# Altium project smarchWatch_V5.PrjPcb
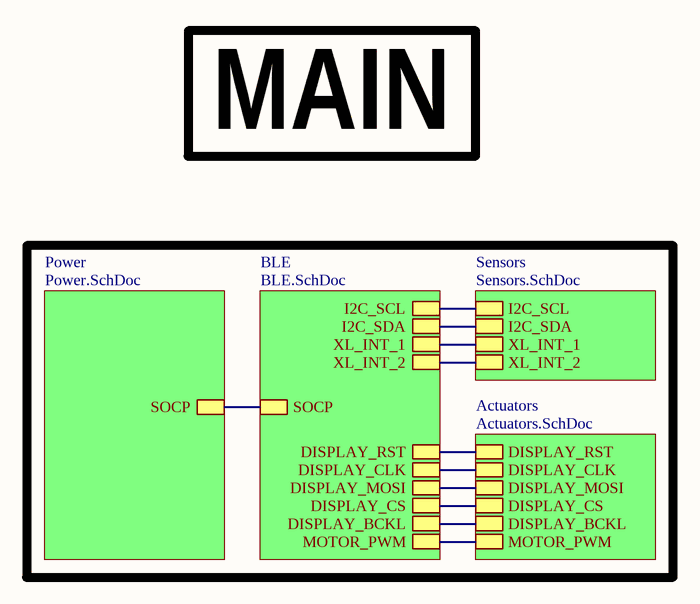
[diagram p0: Main.SchDoc]
5 sheets, 54 parts. Net scope: hierarchical (ports join the sheet entries above them; power ports are global).
Board file: smarchWatch_V5.PcbDoc
Sheets:
  Main.SchDoc
    Power = Power.SchDoc
    Actuators = Actuators.SchDoc
    BLE = BLE.SchDoc
    Sensors = Sensors.SchDoc

## Sheet Main.SchDoc
size A; DocumentNumber: 1; SheetNumber: 1; SheetTotal: 5

### Sub-sheets
Actuators = Actuators.SchDoc: DISPLAY_RST, DISPLAY_CLK, DISPLAY_MOSI, DISPLAY_CS, DISPLAY_BCKL, MOTOR_PWM
BLE = BLE.SchDoc: SOCP, DISPLAY_RST, DISPLAY_CLK, DISPLAY_MOSI, DISPLAY_CS, DISPLAY_BCKL, MOTOR_PWM, I2C_SCL, I2C_SDA, XL_INT_1, XL_INT_2
Power = Power.SchDoc: SOCP
Sensors = Sensors.SchDoc: I2C_SCL, I2C_SDA, XL_INT_1, XL_INT_2

### Nets
DISPLAY_BCKL: sheet Actuators/DISPLAY_BCKL, sheet BLE/DISPLAY_BCKL
DISPLAY_CLK: sheet Actuators/DISPLAY_CLK, sheet BLE/DISPLAY_CLK
DISPLAY_CS: sheet Actuators/DISPLAY_CS, sheet BLE/DISPLAY_CS
DISPLAY_MOSI: sheet Actuators/DISPLAY_MOSI, sheet BLE/DISPLAY_MOSI
DISPLAY_RST: sheet Actuators/DISPLAY_RST, sheet BLE/DISPLAY_RST
I2C_SCL: sheet BLE/I2C_SCL, sheet Sensors/I2C_SCL
I2C_SDA: sheet BLE/I2C_SDA, sheet Sensors/I2C_SDA
MOTOR_PWM: sheet Actuators/MOTOR_PWM, sheet BLE/MOTOR_PWM
SOCP: sheet Power/SOCP, sheet BLE/SOCP
XL_INT_1: sheet BLE/XL_INT_1, sheet Sensors/XL_INT_1
XL_INT_2: sheet BLE/XL_INT_2, sheet Sensors/XL_INT_2

### Notes on the sheet
- MAIN

## Sheet Power.SchDoc
size A; DocumentNumber: 2; SheetNumber: 2; SheetTotal: 5
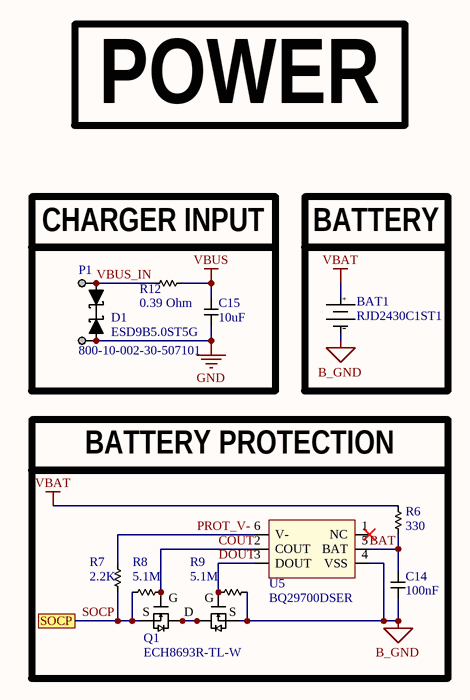
[diagram p1: Power.SchDoc]

### Parts
BAT1  RJD2430C1ST1  [RJD2430C1ST1]
C14  100nF  [CAP_0603_HIGH]
C15  10uF  [CAP_0603_HIGH]
D1  ESD9B5.0ST5G  [ESD9B5.0ST5G]
P1  800-10-002-30-507101  [800-10-002-30-507101]
Q1  ECH8693R-TL-W  [ECH8693R-TL-W]
R6  330  [RES_0603_HIGH]
R7  2.2K  [RES_0603_HIGH]
R8  5.1M  [RES_0603_HIGH]
R9  5.1M  [RES_0603_HIGH]
R12  0.39 Ohm  [RES_0805_HIGH]
U5  BQ29700DSER  [BQ29700DSER]

### Blocks framed on the sheet
CHARGER INPUT: C15 D1 P1 R12
BATTERY: BAT1
BATTERY PROTECTION: C14 Q1 R6-R9 U5

### Ports
SOCP

### Nets
B_GND: BAT1.2(-) C14.2 Q1.3(S2) R9.1 U5.4(VSS)
GND: C15.2 D1.1 P1.2
VBAT: BAT1.1(+) R6.1
VBUS: C15.1 R12.2
BAT: C14.1 R6.2 U5.5(BAT)
COUT: Q1.2(G1) R8.1 U5.2(COUT)
DOUT: Q1.4(G2) R9.2 U5.3(DOUT)
PROT_V-: R7.1 U5.6(V-)
SOCP: Q1.1(S1) R7.2 R8.2 ; port SOCP
VBUS_IN: D1.2 P1.1 R12.1
NetQ1_5: Q1.5(D) Q1.6(D) Q1.7(D) Q1.8(D)

Not connected (* = marked no-connect by the designer): U5 1(NC)*

### Notes on the sheet
- POWER
- (in symbol ECH8693R-TL-W) G; S

### Library data of the parts
BAT1 = RJD2430C1ST1: Coin, 24.5mm 3.7V Lithium-Ion Battery Rechargeable (Secondary) 110mAh
C14 C15 = Capacitor_0603: 0603 Capacitor
D1 = ESD9B5.0ST5G: TVS DIODE 5V SOD923
P1 = 800-10-002-30-507101: 2 Position Spring Mating Target Connector Surface Mount
Q1 = ECH8693R-TL-W: Mosfet Array 2 N-Channel (Dual) Common Drain 24V 14A 1.4W Surface Mount SOT-28FL/ECH8
R6-R9 = Resistor_0603: 0603 Resistor
R12 = Resistor_0805: 0805 Resistor
U5 = BQ29700DSER: Battery Battery Protection IC Lithium-Ion/Polymer 6-WSON (1.5x1.5)

## Sheet Actuators.SchDoc
size A; DocumentNumber: 5; SheetNumber: 5; SheetTotal: 5
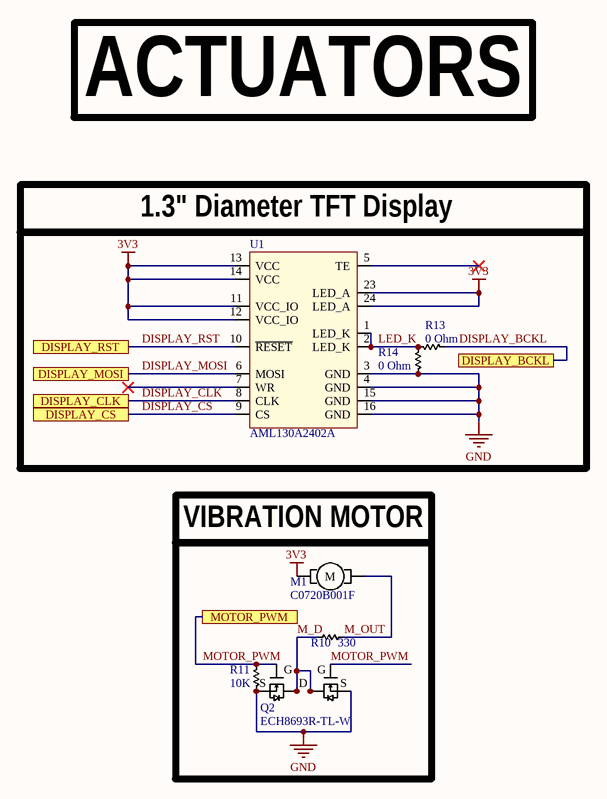
[diagram p2: Actuators.SchDoc]

### Parts
M1  C0720B001F  [C0720B001F]
Q2  ECH8693R-TL-W  [ECH8693R-TL-W]
R10  330  [RES_0603_HIGH]
R11  10K  [RES_0603_HIGH]
R13  0 Ohm  [RES_0603_HIGH]
R14  0 Ohm  [RES_0603_HIGH]  (no BOM)
U1  AML130A2402A  [AML130A2402A]

### Blocks framed on the sheet
1.3" Diameter TFT Display: R13 R14 U1
VIBRATION MOTOR: M1 Q2 R10 R11

### Ports
DISPLAY_BCKL, DISPLAY_CLK, DISPLAY_CS, DISPLAY_MOSI, DISPLAY_RST, MOTOR_PWM

### Nets
3V3: M1.1 U1.11(VCC_IO) U1.12(VCC_IO) U1.13(VCC) U1.14(VCC) U1.23(LED_A) U1.24(LED_A)
GND: Q2.1(S1) Q2.3(S2) R11.1 R14.2 U1.3(GND) U1.4(GND) U1.15(GND) U1.16(GND)
DISPLAY_BCKL: R13.1 ; port DISPLAY_BCKL
DISPLAY_CLK: U1.8(CLK) ; port DISPLAY_CLK
DISPLAY_CS: U1.9(CS) ; port DISPLAY_CS
DISPLAY_MOSI: U1.6(MOSI) ; port DISPLAY_MOSI
DISPLAY_RST: U1.10(~{RESET}) ; port DISPLAY_RST
LED_K: R13.2 R14.1 U1.1(LED_K) U1.2(LED_K)
M_D: Q2.5(D) Q2.6(D) Q2.7(D) Q2.8(D) R10.1
M_OUT: M1.2 R10.2
MOTOR_PWM: Q2.2(G1) Q2.4(G2) R11.2 ; port MOTOR_PWM

Not connected (* = marked no-connect by the designer): U1 5(TE)* 7(WR)*

### Notes on the sheet
- ACTUATORS
- (in symbol C0720B001F) M
- (in symbol ECH8693R-TL-W) G; S

### Library data of the parts
M1 = C0720B001F: DC Motor Vibration, ERM 10000 RPM 3VDC
Q2 = ECH8693R-TL-W: as Q1 on sheet Power
R10 R11 R13 R14 = Resistor_0603: 0603 Resistor
U1 = AML130A2402A: AML130A2402A Round 1.3" TFT Display

## Sheet BLE.SchDoc
size A; DocumentNumber: 3; SheetNumber: 3; SheetTotal: 5
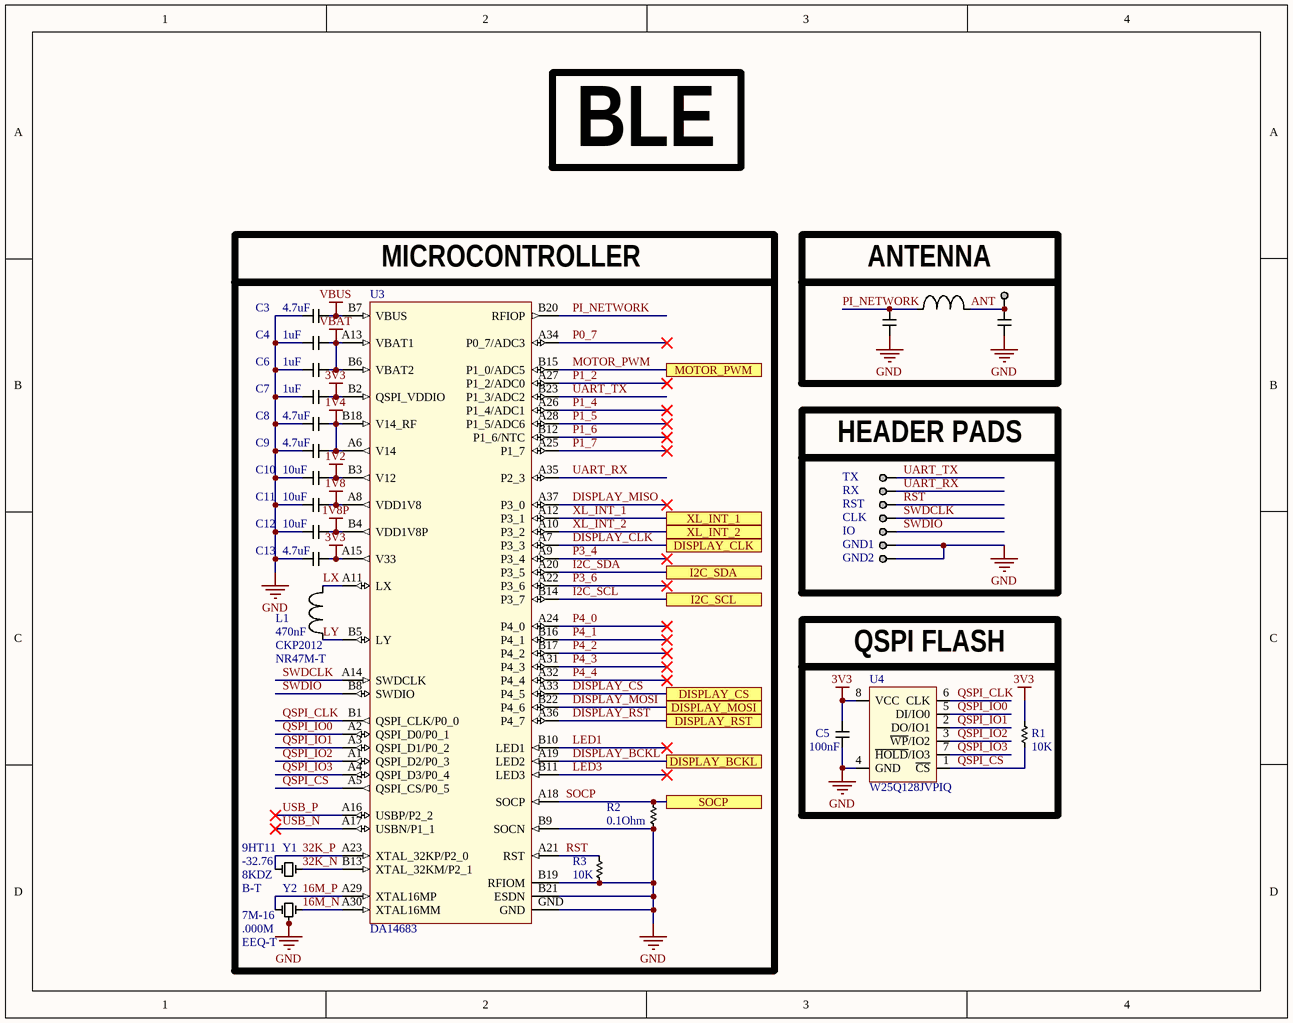
[diagram p3: BLE.SchDoc]

### Parts
ANT1  0.1" Header  [0.1" Header]  (value not drawn)  (no BOM)
C3  4.7uF  [CAP_0603_HIGH]
C4  1uF  [CAP_0603_HIGH]
C5  100nF  [CAP_0603_HIGH]
C6  1uF  [CAP_0603_HIGH]
C7  1uF  [CAP_0603_HIGH]
C8  4.7uF  [CAP_0603_HIGH]
C9  4.7uF  [CAP_0603_HIGH]
C10  10uF  [CAP_0603_HIGH]
C11  10uF  [CAP_0603_HIGH]
C12  10uF  [CAP_0603_HIGH]
C13  4.7uF  [CAP_0603_HIGH]
C16  C  [CAP_0402_MEDIUM]  (value not drawn)  (no BOM)
C17  C  [CAP_0402_MEDIUM]  (value not drawn)  (no BOM)
CLK  0.1" Pad  [0.1" Pad]  (value not drawn)  (no BOM)
GND1  0.1" Pad  [0.1" Pad]  (value not drawn)  (no BOM)
GND2  0.1" Pad  [0.1" Pad]  (value not drawn)  (no BOM)
IO  0.1" Pad  [0.1" Pad]  (value not drawn)  (no BOM)
L1  value 470nF  Parameter 1: CKP2012  Parameter 2: NR47M-T  [IND_0805_HIGH]  (hidden comment: CKP2012NR47M-T)
L2  L  [IND_0402_MEDIUM]  (value not drawn)  (no BOM)
R1  10K  [RES_0603_HIGH]
R2  0.1Ohm  [RES_0603_HIGH]
R3  10K  [RES_0603_HIGH]
RST  0.1" Pad  [0.1" Pad]  (value not drawn)  (no BOM)
RX  0.1" Pad  [0.1" Pad]  (value not drawn)  (no BOM)
TX  0.1" Pad  [0.1" Pad]  (value not drawn)  (no BOM)
U3  DA14683  [DA14683]
U4  W25Q128JVPIQ  [W25Q128JVPIQ]
Y1  Parameter 1: 9HT11  Parameter 2: -32.76  Parameter 3: 8KDZ  Parameter 4: B-T  [9HT11-32.768KDZB-T]  (hidden comment: 9HT11-32.768KDZB-T)
Y2  Parameter 1: 7M-16  Parameter 2: .000M  Parameter 3: EEQ-T  [7M-16.000MEEQ-T]  (hidden comment: 7M-16.000MEEQ-T)

### Blocks framed on the sheet
MICROCONTROLLER: C3 C4 C6-C13 L1 R2 R3 U3 Y1 Y2
ANTENNA: ANT1 C16 C17 L2
HEADER PADS: CLK GND1 GND2 IO RST RX TX
QSPI FLASH: C5 R1 U4

### Ports
DISPLAY_BCKL, DISPLAY_CLK, DISPLAY_CS, DISPLAY_MOSI, DISPLAY_RST, I2C_SCL, I2C_SDA, MOTOR_PWM, SOCP, XL_INT_1, XL_INT_2

### Nets
1V2: C10.1 U3.B3(V12)
1V4: C8.1 C9.1 U3.A6(V14) U3.B18(V14_RF)
1V8: C11.1 U3.A8(VDD1V8)
1V8P: C12.1 U3.B4(VDD1V8P)
3V3: C5.1 C7.1 C13.1 R1.2 U3.A15(V33) U3.B2(QSPI_VDDIO) U4.8(VCC)
GND: C3.2 C4.2 C5.2 C6.2 C7.2 C8.2 C9.2 C10.2 C11.2 C12.2 C13.2 C16.1 C17.1 GND1.1 GND2.1 R2.1 R3.1 U3.B9(SOCN) U3.B19(RFIOM) U3.B21(ESDN) U3.GND U4.4(GND) Y2.2 Y2.4
VBAT: C4.1 C6.1 U3.A13(VBAT1) U3.B6(VBAT2)
VBUS: C3.1 U3.B7(VBUS)
16M_N: U3.A30(XTAL16MM) Y2.3
16M_P: U3.A29(XTAL16MP) Y2.1
32K_N: U3.B13(XTAL_32KM/P2_1) Y1.2
32K_P: U3.A23(XTAL_32KP/P2_0) Y1.1
ANT: ANT1.1 C17.2 L2.1
DISPLAY_BCKL: U3.A19(LED2) ; port DISPLAY_BCKL
DISPLAY_CLK: U3.A7(P3_3) ; port DISPLAY_CLK
DISPLAY_CS: U3.A33(P4_5) ; port DISPLAY_CS
DISPLAY_MISO: U3.A37(P3_0)
DISPLAY_MOSI: U3.B22(P4_6) ; port DISPLAY_MOSI
DISPLAY_RST: U3.A36(P4_7) ; port DISPLAY_RST
I2C_SCL: U3.B14(P3_7) ; port I2C_SCL
I2C_SDA: U3.A20(P3_5) ; port I2C_SDA
LED1: U3.B10(LED1)
LED3: U3.B11(LED3)
LX: L1.2 U3.A11(LX)
LY: L1.1 U3.B5(LY)
MOTOR_PWM: U3.B15(P1_0/ADC5) ; port MOTOR_PWM
P0_7: U3.A34(P0_7/ADC3)
P1_2: U3.A27(P1_2/ADC0)
P1_4: U3.A26(P1_4/ADC1)
P1_5: U3.A28(P1_5/ADC6)
P1_6: U3.B12(P1_6/NTC)
P1_7: U3.A25(P1_7)
P3_4: U3.A9(P3_4)
P3_6: U3.A22(P3_6)
P4_0: U3.A24(P4_0)
P4_1: U3.B16(P4_1)
P4_2: U3.B17(P4_2)
P4_3: U3.A31(P4_3)
P4_4: U3.A32(P4_4)
PI_NETWORK: C16.2 L2.2 U3.B20(RFIOP)
QSPI_CLK: U3.B1(QSPI_CLK/P0_0) U4.6(CLK)
QSPI_CS: R1.1 U3.A5(QSPI_CS/P0_5) U4.1(~{CS})
QSPI_IO0: U3.A2(QSPI_D0/P0_1) U4.5(DI/IO0)
QSPI_IO1: U3.A3(QSPI_D1/P0_2) U4.2(DO/IO1)
QSPI_IO2: U3.A1(QSPI_D2/P0_3) U4.3(~{WP}/IO2)
QSPI_IO3: U3.A4(QSPI_D3/P0_4) U4.7(~{HOLD}/IO3)
RST: R3.2 RST.1 U3.A21(RST)
SOCP: R2.2 U3.A18(SOCP) ; port SOCP
SWDCLK: CLK.1 U3.A14(SWDCLK)
SWDIO: IO.1 U3.B8(SWDIO)
UART_RX: RX.1 U3.A35(P2_3)
UART_TX: TX.1 U3.B23(P1_3/ADC2)
USB_N: U3.A17(USBN/P1_1)
USB_P: U3.A16(USBP/P2_2)
XL_INT_1: U3.A12(P3_1) ; port XL_INT_1
XL_INT_2: U3.A10(P3_2) ; port XL_INT_2

### Notes on the sheet
- BLE

### Library data of the parts
C3-C13 = Capacitor_0603: 0603 Capacitor
C16 C17 = Capacitor_0402: 0402 Capacitor
L1 = Inductor_0805: Parameter 3: *; Parameter 4: *
L2 = Inductor_0402
R1-R3 = Resistor_0603: 0603 Resistor
U3 = DA14683: SmartBond DA14683 Single-chip high-security Bluetooth 5 solution with expandable memory
U4 = W25Q128JVPIQ: FLASH - NOR Memory IC 128Mb (16M x 8) SPI - Quad I/O, QPI, DTR 133MHz  8-WSON (6x5)
Y1 = 9HT11-32.768KDZB-T: 32.768kHz ±20ppm Crystal 6pF 90 kOhms 2-SMD, No Lead
Y2 = 7M-16.000MEEQ-T: 16MHz ±10ppm Crystal 10pF 80 Ohms 4-SMD, No Lead

## Sheet Sensors.SchDoc
size A; DocumentNumber: 4; SheetNumber: 4; SheetTotal: 5
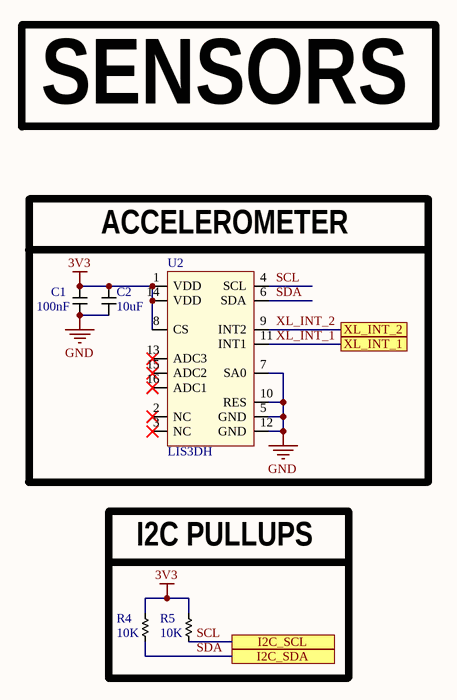
[diagram p4: Sensors.SchDoc]

### Parts
C1  100nF  [CAP_0603_HIGH]
C2  10uF  [CAP_0603_HIGH]
R4  10K  [RES_0603_HIGH]
R5  10K  [RES_0603_HIGH]
U2  LIS3DH  [LIS3DH]

### Blocks framed on the sheet
ACCELEROMETER: C1 C2 U2
I2C PULLUPS: R4 R5

### Ports
I2C_SCL, I2C_SDA, XL_INT_1, XL_INT_2

### Nets
3V3: C1.1 C2.1 R4.2 R5.2 U2.1(VDD) U2.8(CS) U2.14(VDD)
GND: C1.2 C2.2 U2.5(GND) U2.7(SA0) U2.10(RES) U2.12(GND)
SCL: R5.1 U2.4(SCL) ; port I2C_SCL  [project net I2C_SCL]
SDA: R4.1 U2.6(SDA) ; port I2C_SDA  [project net I2C_SDA]
XL_INT_1: U2.11(INT1) ; port XL_INT_1
XL_INT_2: U2.9(INT2) ; port XL_INT_2

Not connected (* = marked no-connect by the designer): U2 2(NC)* 3(NC)* 13(ADC3)* 15(ADC2)* 16(ADC1)*

### Notes on the sheet
- SENSORS

### Library data of the parts
C1 C2 = Capacitor_0603: 0603 Capacitor
R4 R5 = Resistor_0603: 0603 Resistor
U2 = LIS3DH: LIS3DH ACCEL 2-16G I2C/SPI 16LGA

## Nets that join several sheets
3V3: Actuators (7 pins), BLE (7 pins), Sensors (7 pins)
GND: Power (C15.2 D1.1 P1.2), Actuators (8 pins), BLE (24 pins), Sensors (6 pins)
VBAT: Power (BAT1.1 R6.1), BLE (C4.1 C6.1 U3.A13 U3.B6)
VBUS: Power (C15.1 R12.2), BLE (C3.1 U3.B7)
DISPLAY_BCKL: Actuators (R13.1), BLE (U3.A19)
DISPLAY_CLK: Actuators (U1.8), BLE (U3.A7)
DISPLAY_CS: Actuators (U1.9), BLE (U3.A33)
DISPLAY_MOSI: Actuators (U1.6), BLE (U3.B22)
DISPLAY_RST: Actuators (U1.10), BLE (U3.A36)
I2C_SCL: BLE (U3.B14), Sensors (R5.1 U2.4)
I2C_SDA: BLE (U3.A20), Sensors (R4.1 U2.6)
MOTOR_PWM: Actuators (Q2.2 Q2.4 R11.2), BLE (U3.B15)
SOCP: Power (Q1.1 R7.2 R8.2), BLE (R2.2 U3.A18)
XL_INT_1: BLE (U3.A12), Sensors (U2.11)
XL_INT_2: BLE (U3.A10), Sensors (U2.9)